# Altium schematic sheet SDNL.SchDoc: HỆ THỐNG GIÁM SÁT ĐIỆN NĂNG TIÊU THỤ TRONG DÃY NHÀ TRỌ
size A4; SheetNumber: 2; SheetTotal: 2; CourseName: ĐỒ ÁN 2; Student1: Trần Quang Bình; Student2: Hoàng Thiên Ân; Lecturer: ThS Nguyễn Ngô Lâm; StID1: 22161095; StID2: 22161089
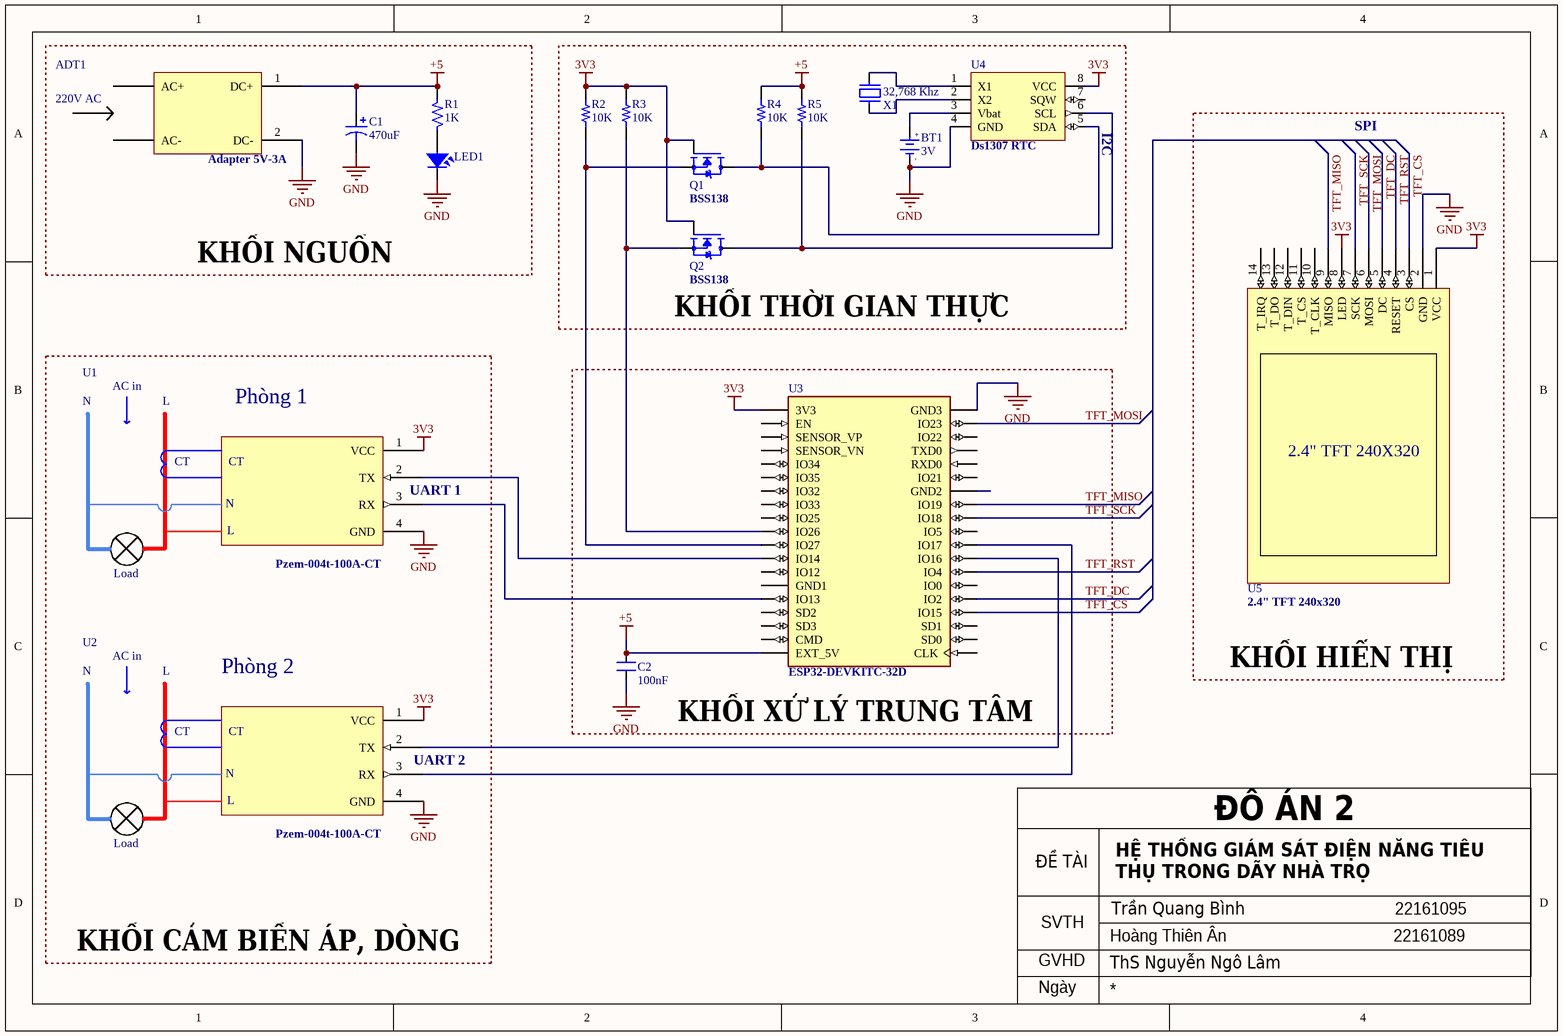
[diagram p0: SDNL.SchDoc]

## Parts
ADT1  Adapter 5V-3A
BT1  3V  [PIN3V]
C1  470uF  [C8mm]
C2  100nF  [CN1]
LED1  LED  [LED-5TRED]  (value not drawn)
Q1  BSS138  [SOT95P240X111-3N]
Q2  BSS138  [SOT95P240X111-3N]
R1  1K  [R1/4W]
R2  10K
R3  10K
R4  10K
R5  10K
U1  Pzem-004t-100A-CT  [Pzem-004t - duplicate1]
U2  Pzem-004t-100A-CT  [Pzem-004t - duplicate1]
U3  ESP32-DEVKITC-32D  [MODULE_ESP32-DEVKITC-32D]
U4  Ds1307 RTC  [Ds1307]
U5  2.4" TFT 240x320  [TFT]
X1  32,768 Khz  [XT32k]

## Blocks framed on the sheet
I2C: BT1 Q1 Q2 R2-R5 U4 X1
SPI: U5

## Nets
3V3: Q1.1(G) Q2.1(G) R2.2 R3.2 U1.1(VCC) U2.1(VCC) U3.1(3V3) U4.8(VCC) U5.1(VCC) U5.8(LED)
+5: ADT1.1(DC+) C1.1 C2.2 R1.2 R4.2 R5.2 U3.19(EXT_5V)
GND: ADT1.2(DC-) BT1.2(GND) C1.2 C2.1 LED1.2 U1.4(GND) U2.4(GND) U3.20(GND3) U4.4(GND) U5.2(GND)
TFT_CS: U3.35(IO15) U5.3(CS)
TFT_DC: U3.34(IO2) U5.5(DC)
TFT_MISO: U3.27(IO19) U5.9(MISO)
TFT_MOSI: U3.21(IO23) U5.6(MOSI)
TFT_RST: U3.32(IO4) U5.4(RESET)
TFT_SCK: U3.28(IO18) U5.7(SCK)
NetBT1_1: BT1.1(+3V) U4.3(Vbat)
NetLED1_1: LED1.1 R1.1
NetQ1_2: Q1.2(S) R2.1 U3.11(IO27)
NetQ1_3: Q1.3(D) R4.1 U4.5(SDA)
NetQ2_2: Q2.2(S) R3.1 U3.10(IO26)
NetQ2_3: Q2.3(D) R5.1 U4.6(SCL)
NetU1_2: U1.2(TX) U3.12(IO14)
NetU1_3: U1.3(RX) U3.15(IO13)
NetU2_2: U2.2(TX) U3.31(IO16)
NetU2_3: U2.3(RX) U3.30(IO17)
NetU4_1: U4.1(X1) X1.2
NetU4_2: U4.2(X2) X1.1

Not connected (* = marked no-connect by the designer): ADT1 ?1(AC+) ?2(AC-); U3 2(EN) 3(SENSOR_VP) 4(SENSOR_VN) 5(IO34) 6(IO35) 7(IO32) 8(IO33) 9(IO25) 13(IO12) 14(GND1) 16(SD2) 17(SD3) 18(CMD) 22(IO22) 23(TXD0) 24(RXD0) 25(IO21) 26(GND2) 29(IO5) 33(IO0) 36(SD1) 37(SD0) 38(CLK); U4 7(SQW); U5 10(T_CLK) 11(T_CS) 12(T_DIN) 13(T_DO) 14(T_IRQ)

## Notes on the sheet
- KHỐI NGUỒN
- (near Q2) KHỐI THỜI GIAN THỰC
- Phòng 1
- (near U1) UART 1
- Phòng 2
- KHỐI HIỂN THỊ
- (near U2) UART 2
- KHỐI XỬ LÝ TRUNG TÂM
- KHỐI CẢM BIẾN ÁP, DÒNG
- ĐỀ TÀI
- GVHD
- SVTH
- Ngày
- (in symbol 2.4" TFT 240x320) 2.4" TFT 240X320
- (in symbol Adapter 5V) 220V AC
- (in symbol PIN 3V) +; -
- (in symbol Pzem-004t-100A-CT) AC in; N; L; CT; Load

## Library data of the parts
ADT1 = Adapter 5V
BT1 = PIN 3V: Battery 3VDC; Value: PIN 3V
C1 = Cap Pol: Polarized Capacitor (Axial); Published: 8-Jun-2000; LatestRevisionDate: 17-Jul-2002; LatestRevisionNote: Re-released for DXP Platform.; PackageReference: POLAR0.8; Publisher: Altium Limited
C2 = CN1: Cap np  1pF - 472pF; Value: 100pF
LED1 = LED: LED Single colour Green and Red; Value: LED 3 ly Single Colour
Q1 Q2 = BSS138: N-Channel 50 V 220mA (Ta) 350mW (Ta) Surface Mount SOT-23-3; MF: onsemi; SnapEDA_Link: https://www.snapeda.com/parts/BSS138/Onsemi/view-part/?ref=snap; Package: SOT-23-3 ON Semiconductor; Value: *; MP: BSS138; Check_prices: https://www.snapeda.com/parts/BSS138/Onsemi/view-part/?ref=eda
R1 = R: Resistor 1/4W; Value: R1/4W - 1K
R2-R5 = Resistor: SMT Resistor
U3 = ESP32-DEVKITC-32D: WiFi Development Tools (802.11) ESP32 General Development Kit, ESP32-WROOM-32D on the board; MF: Espressif Systems; SnapEDA_Link: https://www.snapeda.com/parts/ESP32-DEVKITC-32D/Espressif+Systems/view-part/?ref=snap; Package: None; Value: *; MP: ESP32-DEVKITC-32D; Check_prices: https://www.snapeda.com/parts/ESP32-DEVKITC-32D/Espressif+Systems/view-part/?ref=eda
U4 = Ds1307
X1 = XT32k: Crystal 32,768kHz for timer real; Value: 32,768khz